# Altium schematic sheet 01_Top.SchDoc: OpenCamera Slider - Top level schematic
size A4; SheetNumber: 1; SheetTotal: 4; sk_ProjectName: WInFiDEL Sensor; sk_Title: Overview
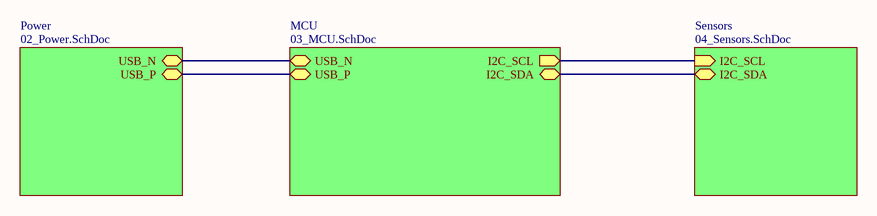
[diagram p0: 01_Top.SchDoc]

## Sub-sheets
MCU = 03_MCU.SchDoc: USB_N (bidir), USB_P (bidir), I2C_SCL (out), I2C_SDA (bidir)
Power = 02_Power.SchDoc: USB_N (bidir), USB_P (bidir)
Sensors = 04_Sensors.SchDoc: I2C_SCL (in), I2C_SDA (bidir)

## Nets
(unnamed): sheet Power/USB_N, sheet MCU/USB_N
(unnamed): sheet Power/USB_P, sheet MCU/USB_P
(unnamed): sheet MCU/I2C_SCL, sheet Sensors/I2C_SCL
(unnamed): sheet MCU/I2C_SDA, sheet Sensors/I2C_SDA

## Notes on the sheet
- Page
- Title
- www.SasaKaranovic.com <http://www.SasaKaranovic.com>
- of